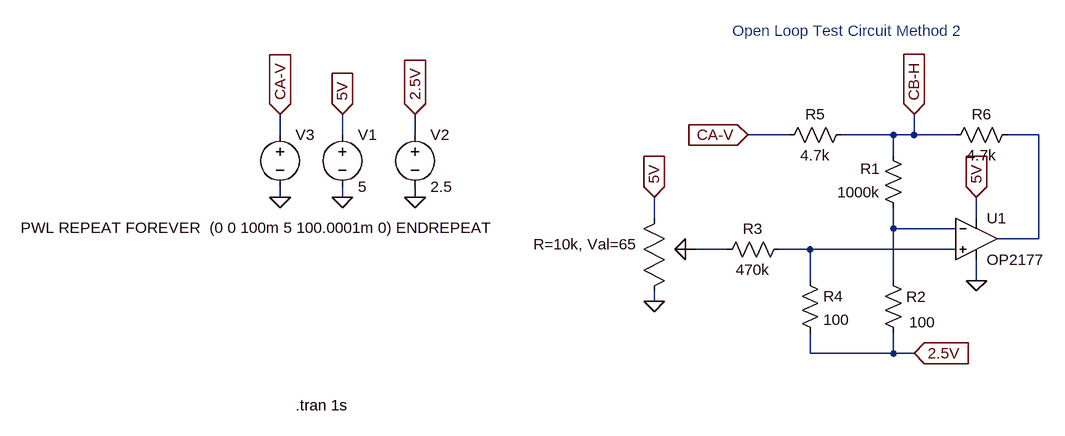
[diagram p0: schematic open_loop_gain_test_ckt2_ltspice.asc]
open_loop_gain_test_ckt2_ltspice.asc, the LTspice schematic file:
Version 4
SHEET 1 880 680
WIRE -864 16 -864 -16
WIRE -768 16 -768 -16
WIRE -656 16 -656 -16
WIRE -80 16 -144 16
WIRE 80 16 0 16
WIRE 112 16 112 -16
WIRE 112 16 80 16
WIRE 176 16 112 16
WIRE 304 16 256 16
WIRE 80 48 80 16
WIRE -864 112 -864 96
WIRE -768 112 -768 96
WIRE -656 112 -656 96
WIRE -288 144 -288 112
WIRE 208 144 208 112
WIRE 80 160 80 128
WIRE 176 160 80 160
WIRE 304 176 304 16
WIRE 304 176 240 176
WIRE -176 192 -224 192
WIRE -48 192 -96 192
WIRE 176 192 -48 192
WIRE -48 240 -48 192
WIRE 80 240 80 160
WIRE 208 240 208 208
WIRE -288 272 -288 256
WIRE -48 352 -48 320
WIRE 80 352 80 320
WIRE 80 352 -48 352
WIRE 112 352 80 352
FLAG 208 240 0
FLAG 208 112 5V
IOPIN 208 112 In
FLAG 112 -16 CB-H
IOPIN 112 -16 In
FLAG 112 352 2.5V
IOPIN 112 352 In
FLAG -144 16 CA-V
IOPIN -144 16 In
FLAG -288 272 0
FLAG -288 112 5V
IOPIN -288 112 In
FLAG -768 112 0
FLAG -656 112 0
FLAG -864 112 0
FLAG -768 -16 5V
IOPIN -768 -16 In
FLAG -656 -16 2.5V
IOPIN -656 -16 In
FLAG -864 -16 CA-V
IOPIN -864 -16 In
SYMBOL res 96 144 R180
WINDOW 0 36 76 Left 2
WINDOW 3 36 40 Left 2
SYMATTR InstName R1
SYMATTR Value 1000k
SYMBOL res 96 336 R180
WINDOW 0 -35 71 Left 2
WINDOW 3 -49 32 Left 2
SYMATTR InstName R2
SYMATTR Value 100
SYMBOL res -192 208 R270
WINDOW 0 32 56 VTop 2
WINDOW 3 0 56 VBottom 2
SYMATTR InstName R3
SYMATTR Value 470k
SYMBOL res -64 224 R0
SYMATTR InstName R4
SYMATTR Value 100
SYMBOL potentiometer -272 160 M0
WINDOW 0 26 -31 Invisible 0
WINDOW 39 42 24 Left 2
SYMATTR InstName X1
SYMATTR SpiceLine R=10k, Val=65
SYMBOL voltage -768 0 R0
WINDOW 123 0 0 Left 0
WINDOW 39 0 0 Left 0
SYMATTR InstName V1
SYMATTR Value 5
SYMBOL voltage -656 0 R0
WINDOW 123 0 0 Left 0
WINDOW 39 0 0 Left 0
SYMATTR InstName V2
SYMATTR Value 2.5
SYMBOL voltage -864 0 R0
WINDOW 3 -399 159 Left 2
WINDOW 123 0 0 Left 0
WINDOW 39 0 0 Left 0
SYMATTR Value PWL REPEAT FOREVER  (0 0 100m 5 100.0001m 0) ENDREPEAT
SYMATTR InstName V3
SYMBOL res 16 0 R90
WINDOW 0 0 56 VBottom 2
WINDOW 3 32 56 VTop 2
SYMATTR InstName R5
SYMATTR Value 4.7k
SYMBOL res 272 0 R90
WINDOW 0 0 56 VBottom 2
WINDOW 3 32 56 VTop 2
SYMATTR InstName R6
SYMATTR Value 4.7k
SYMBOL Opamps\\OP2177 208 112 R0
SYMATTR InstName U1
TEXT -168 -144 Left 2 ;Open Loop Test Circuit Method 2
TEXT -840 432 Left 2 !.tran 1s

The netlist it stands for:
* open_loop_gain_test_ckt2_ltspice.asc
R1 N002 CB-H 1000k
R2 2.5V N002 100
R3 N003 N004 470k
R4 N004 2.5V 100
XX1 5V N003 0 potentiometer R=10k, Val=65  ; pins 1 2 3
V1 5V 0 5
V2 2.5V 0 2.5
V3 CA-V 0 PWL REPEAT FOREVER  (0 0 100m 5 100.0001m 0) ENDREPEAT
R5 CB-H CA-V 4.7k
R6 N001 CB-H 4.7k
XU1 N004 N002 5V 0 N001 OP2177  ; pins In+ In- V+ V- OUT
* Open Loop Test Circuit Method 2
.tran 1s
.backanno
.end